# Altium schematic sheet 11-DFlipFlop.SchDoc
size A4
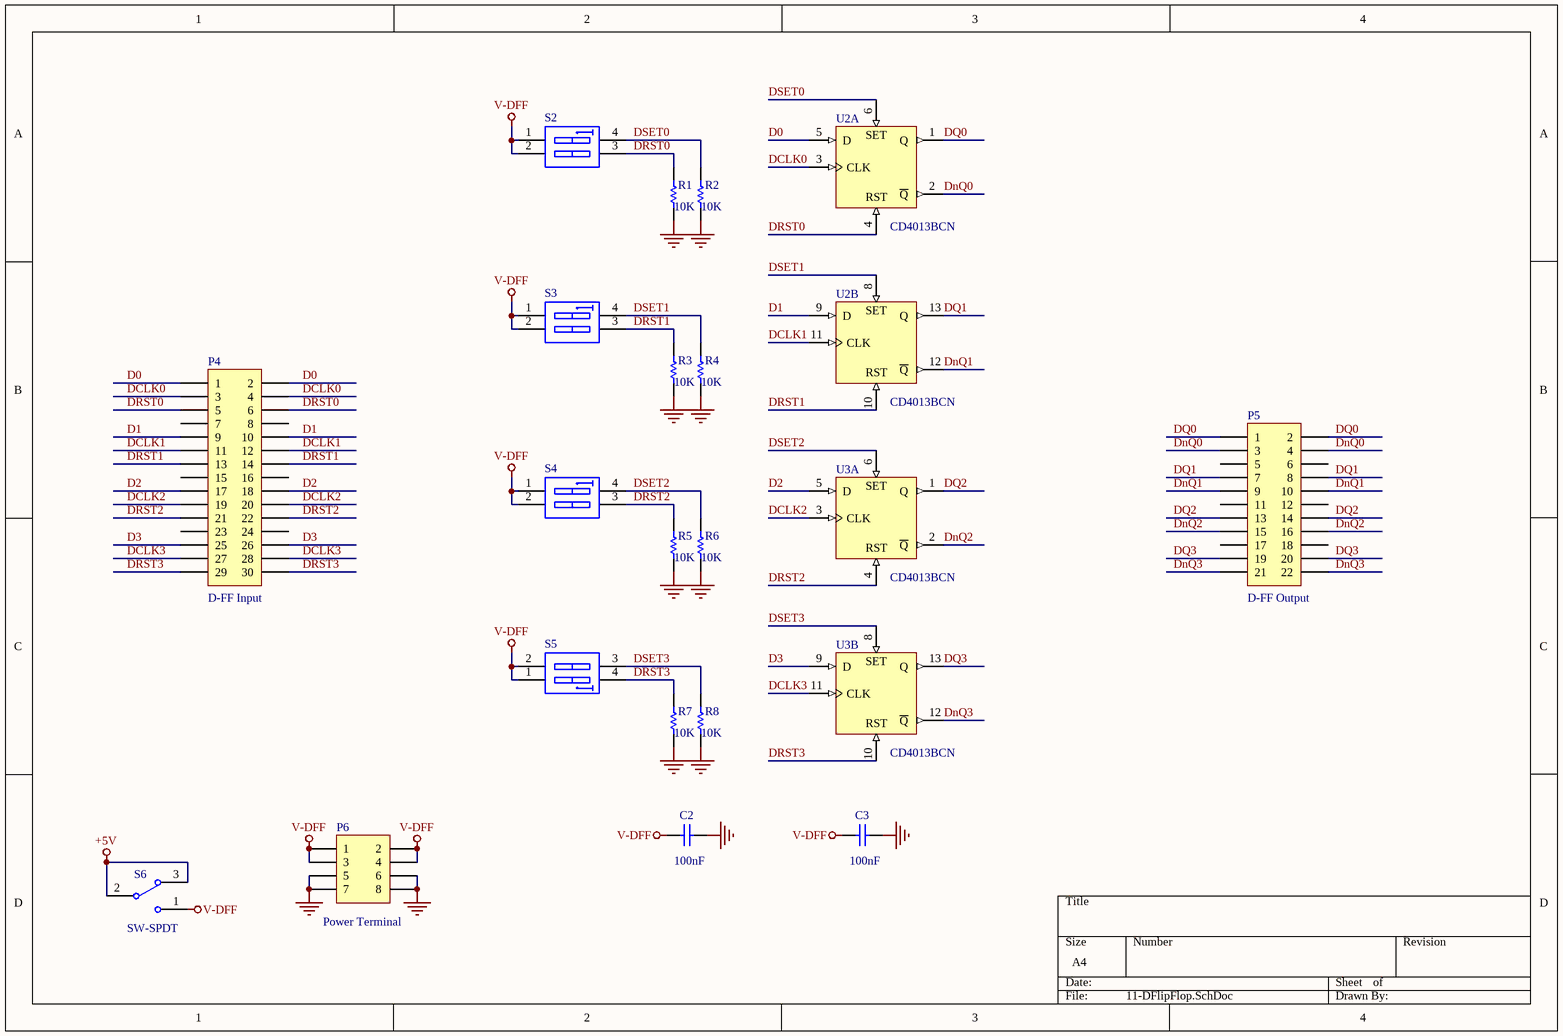
[diagram p0: 11-DFlipFlop.SchDoc]

## Parts
C2  value 100nF  [C-0805]  (hidden comment: 104)
C3  value 100nF  [C-0805]  (hidden comment: 104)
P4  value D-FF Input  [HDR2X15]  (hidden comment: Header 15X2)
P5  value D-FF Output  [HDR2X11]  (hidden comment: Header 11X2)
P6  Publisher: Power Terminal  [HDR2X4]  (hidden comment: Header 4X2)
R1  10K  [r-0805]
R2  10K  [r-0805]
R3  10K  [r-0805]
R4  10K  [r-0805]
R5  10K  [r-0805]
R6  10K  [r-0805]
R7  10K  [r-0805]
R8  10K  [r-0805]
S2  SW DIP-2  [sw-dip2]  (value not drawn)
S3  SW DIP-2  [sw-dip2]  (value not drawn)
S4  SW DIP-2  [sw-dip2]  (value not drawn)
S5  SW DIP-2  [sw-dip2]  (value not drawn)
S6  SW-SPDT  [SW-DIP1SMD]
U2  CD4013BCN  [SK-DIP14-300]  (parts A,B of 2)
U3  CD4013BCN  [SK-DIP14-300]  (parts A,B of 2)

## Nets
+5V: S6.2 S6.3
GND: C2.2 C3.2 P6.5 P6.6 P6.7 P6.8 R1.1 R2.1 R3.1 R4.1 R5.1 R6.1 R7.1 R8.1 U2.7(GND) U3.7(GND)
V-DFF: C2.1 C3.1 P6.1 P6.2 P6.3 P6.4 S2.1(A1) S2.2(A2) S3.1(A1) S3.2(A2) S4.1(A1) S4.2(A2) S5.1(A1) S5.2(A2) S6.1
VDD: U2.14(V-DFF) U3.14(V-DFF)
D0: P4.1 P4.2 U2.5(D)
D1: P4.9 P4.10 U2.9(D)
D2: P4.17 P4.18 U3.5(D)
D3: P4.25 P4.26 U3.9(D)
DCLK0: P4.3 P4.4 U2.3(CLK)
DCLK1: P4.11 P4.12 U2.11(CLK)
DCLK2: P4.19 P4.20 U3.3(CLK)
DCLK3: P4.27 P4.28 U3.11(CLK)
DnQ0: P5.3 P5.4 U2.2(~{Q})
DnQ1: P5.9 P5.10 U2.12(~{Q})
DnQ2: P5.15 P5.16 U3.2(~{Q})
DnQ3: P5.21 P5.22 U3.12(~{Q})
DQ0: P5.1 P5.2 U2.1(Q)
DQ1: P5.7 P5.8 U2.13(Q)
DQ2: P5.13 P5.14 U3.1(Q)
DQ3: P5.19 P5.20 U3.13(Q)
DRST0: P4.5 P4.6 R1.2 S2.3(B2) U2.4(RST)
DRST1: P4.13 P4.14 R3.2 S3.3(B2) U2.10(RST)
DRST2: P4.21 P4.22 R5.2 S4.3(B2) U3.4(RST)
DRST3: P4.29 P4.30 R7.2 S5.4(B1) U3.10(RST)
DSET0: R2.2 S2.4(B1) U2.6(S)
DSET1: R4.2 S3.4(B1) U2.8(S)
DSET2: R6.2 S4.4(B1) U3.6(S)
DSET3: R8.2 S5.3(B2) U3.8(S)

Not connected (* = marked no-connect by the designer): P4 7 8 15 16 23 24; P5 5 6 11 12 17 18

## Notes on the sheet
- (in symbol CD4013BCN, part A) SET
- (in symbol CD4013BCN, part B) SET

## Library data of the parts
C2 C3 = Cap: Capacitor; Published: 8-Jun-2000; LatestRevisionDate: 17-Jul-2002; LatestRevisionNote: Re-released for DXP Platform.; PackageReference: RAD-0.3; Publisher: Altium Limited; PackageDescription: Radial Cap, Thru-Hole; 2 Leads; 0.3 in Pin Spacing
P4 = Header 15X2: Header, 15-Pin, Dual row; LatestRevisionDate: 17-Jul-2002; LatestRevisionNote: Re-released for DXP Platform.
P5 = Header 11X2: Header, 11-Pin, Dual row; LatestRevisionDate: 17-Jul-2002; LatestRevisionNote: Re-released for DXP Platform.
P6 = Header 4X2: Header, 4-Pin, Dual row; LatestRevisionDate: 17-Jul-2002; LatestRevisionNote: Re-released for DXP Platform.
R1-R8 = Res1: Resistor; Published: 8-Jun-2000; LatestRevisionDate: 17-Jul-2002; LatestRevisionNote: Re-released for DXP Platform.; PackageReference: AXIAL-0.3; Publisher: Altium Limited; PackageDescription: Axial Device, Thru-Hole; 2 Leads; 0.3 in Pin Spacing; Value: 10K
S2-S5 = SW DIP-2: DIP Switch, 2 Position, SPST; Published: 24-Mar-1999; LatestRevisionDate: 17-Jul-2002; LatestRevisionNote: Re-released for DXP Platform.; PackageReference: DIP-4; Publisher: Altium Limited
S6 = SW-SPDT: SPDT Subminiature Toggle Switch, Right Angle Mounting, Vertical Actuation; Published: 24-Mar-1999; LatestRevisionDate: 17-Dec-2003; LatestRevisionNote: Schematic revised, PCB Footprint replaced.; DatasheetVersion: 05-Dec-2000; PackageReference: TL36WW15050; Publisher: Altium Limited; PackageDescription: Switch; 4 Leads; ComponentLink1Description: Manufacturer Link; ComponentLink1URL: http://www.apem.com
U2 U3 = CD4013BCN: Dual D-Type Flip-Flop; Published: 17-Jul-2002; LatestRevisionDate: 29-May-2009; LatestRevisionNote: Component Body Added.; DatasheetVersion: Jan-1999; PackageVersion: 2000; PackageReference: N14A; Publisher: Altium Limited; PackageDescription: DIP, 14-Pin, Row Spacing 7.62 mm, Pitch 2.54 mm; ComponentLink1Description: Manufacturer Link; ComponentLink1URL: http://www.fairchildsemi.com/